# EAGLE design LinCorrector4 (EAGLE 7.4.0)
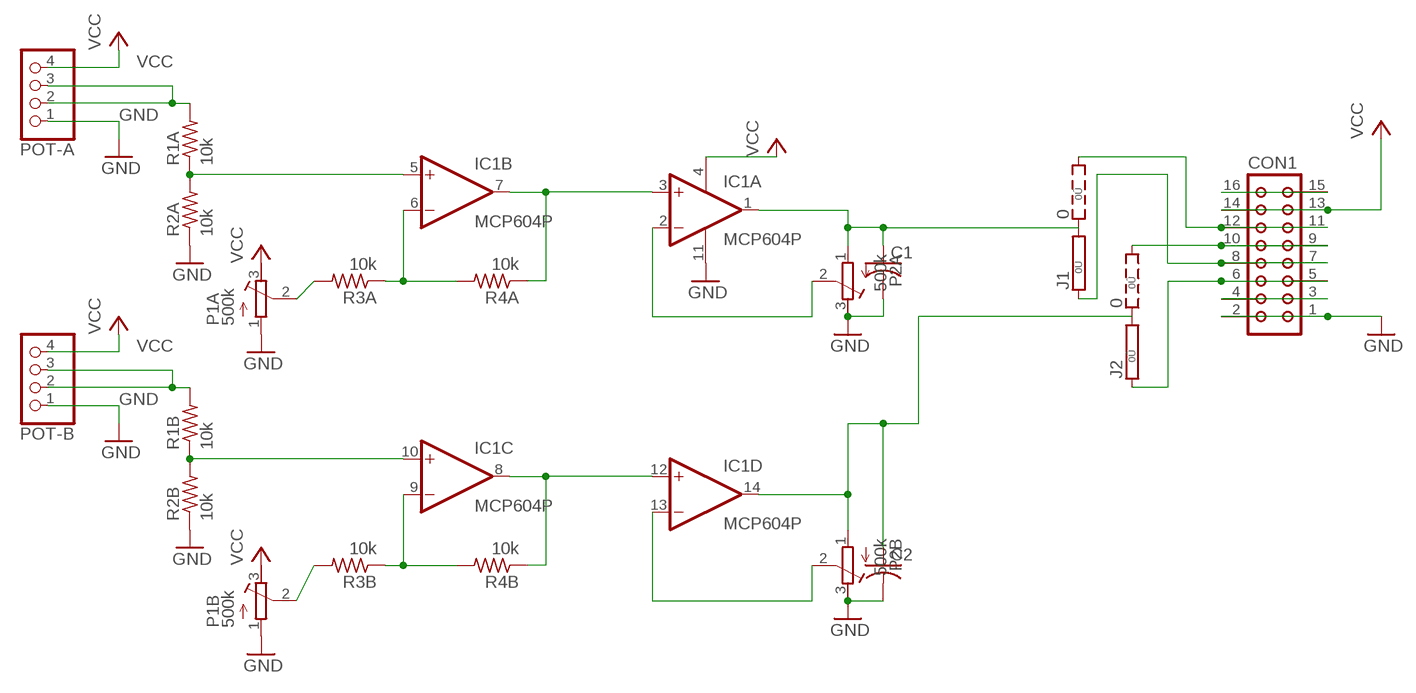
[diagram p0: schematic, sheet 1]

## Parts
C1  C-US050-030X075  [C050-030X075]
C2  C-US050-030X075  [C050-030X075]
CON1  CON16  [CON16]
IC1  MCP604P  [DIL14]
J1  0  0R2  [0R2/10]
J2  0  0R2  [0R2/10]
P1A  500k  R-TRIMM3296W  [RTRIM3296W]
P1B  500k  R-TRIMM3296W  [RTRIM3296W]
P2A  500k  R-TRIMM3296W  [RTRIM3296W]
P2B  500k  R-TRIMM3296W  [RTRIM3296W]
POT-A  PINHD-1X4/90  [1X04/90]
POT-B  PINHD-1X4/90  [1X04/90]
R1A  10k  R-US_0204/7  [0204/7]
R1B  10k  R-US_0204/7  [0204/7]
R2A  10k  R-US_0204/7  [0204/7]
R2B  10k  R-US_0204/7  [0204/7]
R3A  10k  R-US_0204/7  [0204/7]
R3B  10k  R-US_0204/7  [0204/7]
R4A  10k  R-US_0204/7  [0204/7]
R4B  10k  R-US_0204/7  [0204/7]

## Nets
GND: C1.2 C2.2 CON1.1 CON1.2 IC1.11(P:V-) P1A.1(A) P1B.1(A) P2A.3(E) P2B.3(E) POT-A.1 POT-B.1 R2A.1 R2B.1
N$1: IC1.5(B:+IN) R1A.1 R2A.2
N$2: POT-A.2 POT-A.3 R1A.2
N$3: P1A.2(S) R3A.2
N$4: IC1.6(B:-IN) R3A.1 R4A.2
N$5: IC1.3(A:+IN) IC1.7(B:OUT) R4A.1
N$6: IC1.10(C:+IN) R1B.1 R2B.2
N$7: IC1.2(A:-IN) P2A.2(S)
N$8: C1.1 IC1.1(A:OUT) J1.2 P2A.1(A)
N$9: P1B.2(S) R3B.2
N$10: IC1.9(C:-IN) R3B.1 R4B.2
N$11: IC1.8(C:OUT) IC1.12(D:+IN) R4B.1
N$12: IC1.13(D:-IN) P2B.2(S)
N$13: C2.1 IC1.14(D:OUT) J2.2 P2B.1(A)
N$14: POT-B.2 POT-B.3 R1B.2
N$15: CON1.11 CON1.12 J1.3
N$16: CON1.9 CON1.10 J2.3
N$17: CON1.15 CON1.16
N$18: CON1.3 CON1.4
N$32: CON1.7 CON1.8 J1.1
N$36: CON1.5 CON1.6 J2.1
VCC: CON1.13 CON1.14 IC1.4(P:V+) P1A.3(E) P1B.3(E) POT-A.4 POT-B.4

## Library data of the parts
C1 C2 = adafruit:C-US: CAPACITOR, American symbol
CON1 = con-harting:CON16: CONNECTOR; OC_FARNELL: unknown; OC_NEWARK: unknown
IC1 = linear:MCP604: Quad Op Amp 2.7V to 6.0V Single Supply CMOS Source: http://ww1.microchip.com/downloads/en/DeviceDoc/21314g.pdf
J1 J2 = jumper:0R2: Bridge switch 0R 2 x 10mm
P1A P1B P2A P2B = resistor:R-TRIMM: Trimm resistor
POT-A POT-B = pinhead:PINHD-1X4: PIN HEADER
R1A R1B R2A R2B R3A R3B R4A R4B = rcl:R-US_: RESISTOR, American symbol

## Net classes
0 default: width 0.381 mm, drill 0.508 mm, clearance 0.381 mm

## Board
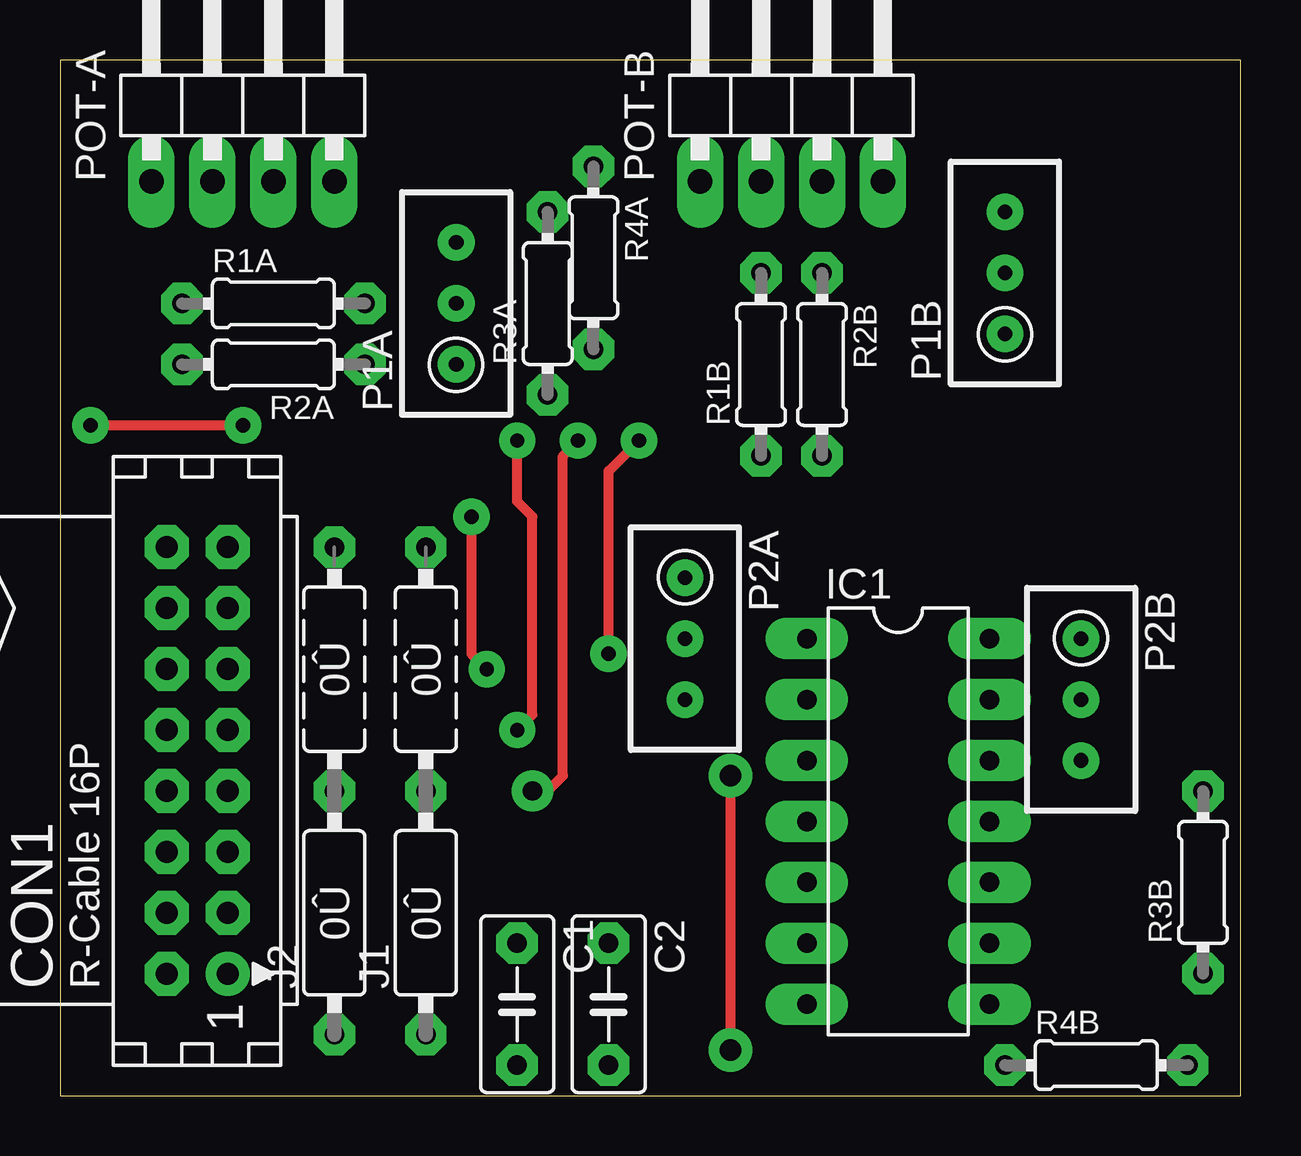
[diagram p1: board, top side]
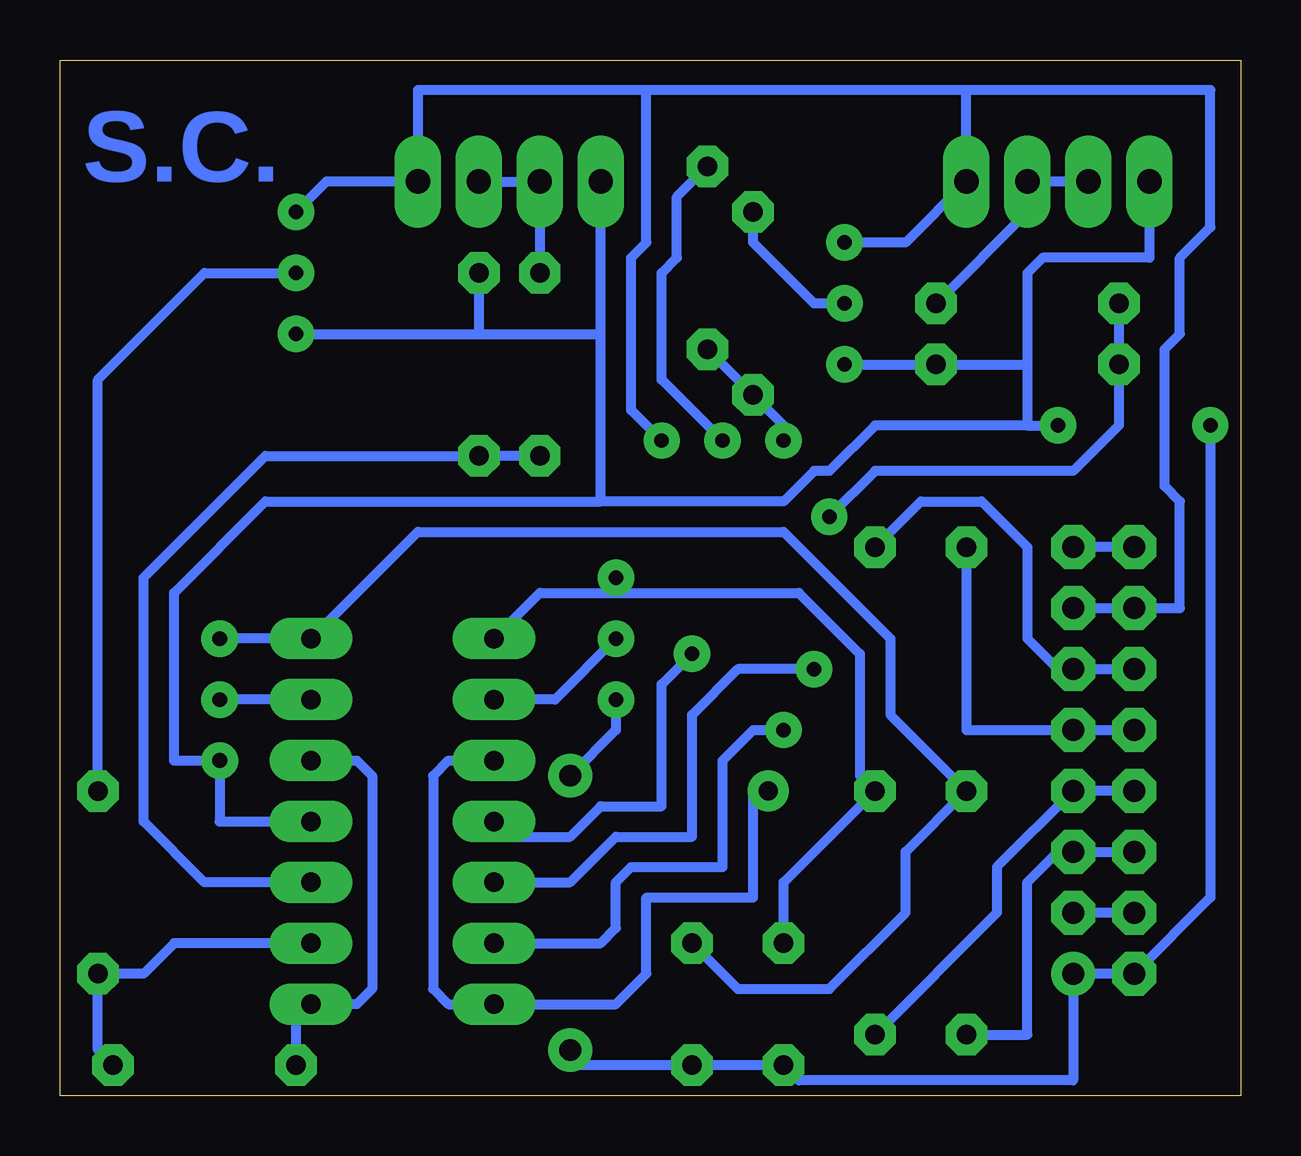
[diagram p2: board, bottom side, seen from below]

Size 49.2 x 43.17 mm. Coordinates in mm from the lower left corner, seen from the top.
Outline: 0,0 49.2,0 49.2,43.17 0,43.17 0,0
Copper layers (1*16): Top 0.035mm / dielectric 1.5mm / Bottom 0.035mm
Design rules "default *": minimum track width 15mil, minimum drill 32mil, track to track 20mil, track to pad 20mil, pad to pad 20mil, via to via 20mil, smd to smd 0mil, copper to edge 0mil, drill to drill 60mil, minimum pad ring 18mil, minimum via ring 18mil, stop-mask expansion 0mil, vias tented up to drill 0mil, thermal gap 10mil

### Footprints (pad centres in the part's own frame; a part is rotated, then mirrored left to right if it is on the bottom)
C050-030X075 = drill 0.813 octagon: 1 -2.54,0; 2 2.54,0
CON16 = drill 0.914: 1 -8.89,-1.27 | drill 0.914 octagon: 2 -8.89,1.27; 3 -6.35,-1.27; 4 -6.35,1.27; 5 -3.81,-1.27; 6 -3.81,1.27; 7 -1.27,-1.27; 8 -1.27,1.27; 9 1.27,-1.27; 10 1.27,1.27; 11 3.81,-1.27; 12 3.81,1.27; 13 6.35,-1.27; 14 6.35,1.27; 15 8.89,-1.27; 16 8.89,1.27
DIL14 = drill 0.813 long: 1 -7.62,-3.81; 2 -5.08,-3.81; 3 -2.54,-3.81; 4 0,-3.81; 5 2.54,-3.81; 6 5.08,-3.81; 7 7.62,-3.81; 8 7.62,3.81; 9 5.08,3.81; 10 2.54,3.81; 11 0,3.81; 12 -2.54,3.81; 13 -5.08,3.81; 14 -7.62,3.81
0R2/10 = drill 0.813 pad 1.6 octagon: 1 -5.08,0; 2 5.08,0; 3 15.24,0
RTRIM3296W = drill 0.61: 1 0,-2.54; 2 0,0; 3 0,2.54
1X04/90 = drill 1.016 long: 1 -3.81,-3.81; 2 -1.27,-3.81; 3 1.27,-3.81; 4 3.81,-3.81
0204/7 = drill 0.813 octagon: 1 -3.81,0; 2 3.81,0

### Placement (x,y rotation side)
C1  19.05,3.81 270 top
C2  22.86,3.81 270 top
CON1  5.71,13.97 90 top
IC1  34.92,11.43 270 top
J1  15.24,7.62 90 top
J2  11.43,7.62 90 top
P1A  16.51,33.02 0 top
P1B  39.37,34.29 0 top
P2A  26.04,19.05 180 top
P2B  42.55,16.51 180 top
POT-A  7.62,41.91 0 top
POT-B  30.48,41.91 0 top
R1A  8.89,33.02 0 top
R1B  29.21,30.48 90 top
R2A  8.89,30.48 180 top
R2B  31.75,30.48 270 top
R3A  20.32,33.02 90 top
R3B  47.62,8.89 90 top
R4A  22.23,34.92 270 top
R4B  43.18,1.27 0 top

### Tracks (layer width: path | path; a pad name or v marks a point on that pad's centre or on a via)
GND  (via drill 0.6, 0.9 pad 0.61)
  Top 0.406: v7.62,27.94 v1.27,27.94 | v27.94,1.91 v27.94,13.34
  Bottom 0.406: v1.27,27.94 1.27,8.26 CON1.2 CON1.1 6.99,0.64 18.41,0.64 C1.2 C2.2 27.94,1.27 v27.94,1.91 | P1A.1 R2A.1 8.89,30.48 | 26.67,24.77 26.67,31.75 | 26.67,31.75 POT-B.1 | IC1.11 42.55,11.43 P2B.3 44.45,13.97 44.45,20.95 40.64,24.77 26.67,24.77 | 8.89,30.48 8.89,27.94 | POT-A.1 3.81,34.92 8.26,34.92 8.89,34.29 8.89,30.48 | 8.89,27.94 15.24,27.94 17.14,26.04 17.78,26.04 19.05,24.77 26.67,24.77 | P1B.1 31.75,31.75 | 31.75,31.75 26.67,31.75 | R2B.1 31.75,31.75 | 8.89,27.94 v7.62,27.94 | P2A.3 26.04,15.24 v27.94,13.34
N$1  (via drill 0.6)
  Top 0.406: v17.14,24.13 17.14,18.41 v17.78,17.78
  Bottom 0.406: R1A.1 R2A.2 5.08,27.94 6.99,26.04 15.24,26.04 v17.14,24.13 | IC1.5 27.94,8.89 26.04,10.79 22.86,10.79 22.86,15.88 20.95,17.78 v17.78,17.78
N$2
  Bottom 0.406: POT-A.2 POT-A.3 8.89,36.83 R1A.2
N$3
  Bottom 0.406: P1A.2 17.78,33.02 20.32,35.56 R3A.2
N$4  (via drill 0.6)
  Top 0.406: v19.05,15.24 19.68,15.88 19.68,24.13 19.05,24.77 v19.05,27.3
  Bottom 0.406: IC1.6 26.67,6.35 26.04,6.99 26.04,8.89 25.4,9.53 21.59,9.53 21.59,13.97 20.32,15.24 v19.05,15.24 | v19.05,27.3 19.05,27.94 R3A.1 R4A.2
N$5  (via drill 0.6, 0.8)
  Top 0.406: v19.68,12.7 20.32,12.7 20.95,13.34 20.95,26.67 v21.59,27.3
  Bottom 0.406: v19.68,12.7 20.32,12.7 20.32,8.26 24.77,8.26 24.77,5.08 26.04,3.81 IC1.7 33.02,3.81 33.66,4.45 33.66,13.34 33.02,13.97 IC1.3 | v21.59,27.3 24.13,29.84 24.13,34.29 23.5,34.92 23.5,37.47 R4A.1
N$6
  Bottom 0.406: R1B.1 R2B.2 40.64,26.67 45.72,21.59 45.72,11.43 43.18,8.89 IC1.10
N$7
  Bottom 0.406: P2A.2 28.57,16.51 IC1.2
N$8
  Bottom 0.406: IC1.1 29.21,20.95 26.04,20.95 | P2A.1 26.04,20.95 | 26.04,20.95 18.41,20.95 15.88,18.41 15.88,13.34 J1.2 19.05,8.89 C1.1
N$9
  Bottom 0.406: R3B.2 47.62,29.84 43.18,34.29 P1B.2
N$10
  Bottom 0.406: R4B.2 47.62,1.91 R3B.1 45.72,5.08 44.45,6.35 IC1.9
N$11
  Bottom 0.406: R4B.1 39.37,3.17 IC1.8 36.83,3.81 36.2,4.45 36.2,13.34 36.83,13.97 IC1.12
N$12
  Bottom 0.406: IC1.13 P2B.2
N$13
  Bottom 0.406: P2B.1 IC1.14 34.29,23.5 19.05,23.5 14.61,19.05 14.61,15.88 J2.2 13.97,10.16 13.97,7.62 17.14,4.45 20.95,4.45 C2.1
N$14
  Bottom 0.406: POT-B.3 POT-B.2 R1B.2
N$15
  Bottom 0.406: J1.3 13.34,24.77 10.79,24.77 8.89,22.86 8.89,19.05 7.62,17.78 CON1.11 CON1.12
N$16
  Bottom 0.406: J2.3 11.43,15.24 CON1.9 CON1.10
N$17
  Bottom 0.406: CON1.16 CON1.15
N$18
  Bottom 0.406: CON1.4 CON1.3
N$32
  Bottom 0.406: CON1.8 CON1.7 10.16,9.53 10.16,7.62 J1.1
N$36
  Bottom 0.406: J2.1 8.89,2.54 8.89,8.89 7.62,10.16 CON1.5 CON1.6
VCC  (via drill 0.6)
  Top 0.406: v22.86,18.41 22.86,26.04 v24.13,27.3
  Bottom 0.406: CON1.13 CON1.14 2.54,20.32 2.54,24.77 3.17,25.4 3.17,31.11 2.54,31.75 2.54,34.92 1.27,36.2 1.27,41.91 11.43,41.91 | 11.43,41.91 24.77,41.91 | 24.77,41.91 34.29,41.91 POT-B.4 38.1,38.1 P1B.3 | 11.43,41.91 POT-A.4 13.97,35.56 P1A.3 | IC1.4 30.48,10.79 27.94,10.79 26.67,12.06 24.13,12.06 24.13,17.14 v22.86,18.41 | v24.13,27.3 25.4,28.57 25.4,34.92 24.77,35.56 24.77,41.91

### Text on the board
Bottom: S.C.